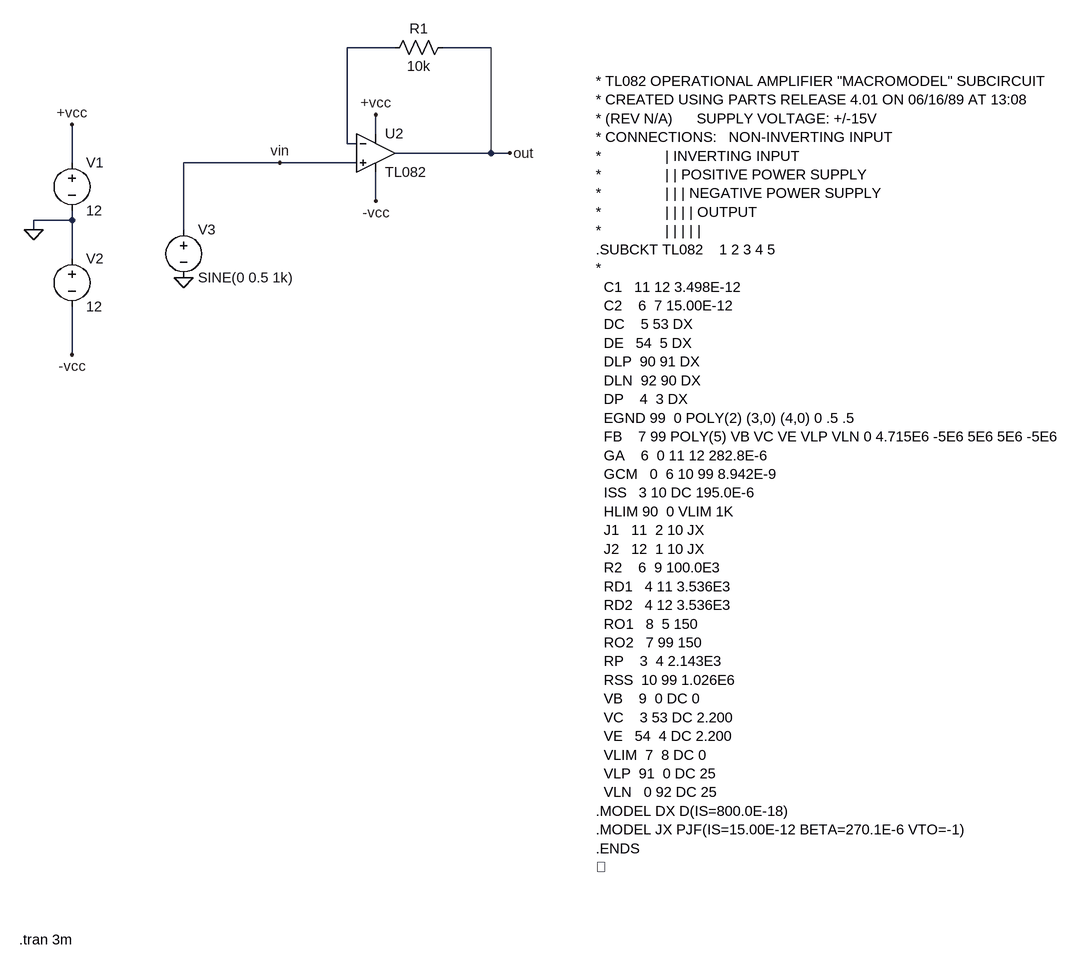
[diagram p0: schematic circuito com TL082.asc]
circuito com TL082.asc, the LTspice schematic file:
Version 4
SHEET 1 2480 11288
WIRE 720 -96 640 -96
WIRE 880 -96 800 -96
WIRE 688 48 688 16
WIRE 640 64 640 -96
WIRE 656 64 640 64
WIRE 880 80 880 -96
WIRE 880 80 720 80
WIRE 912 80 880 80
WIRE 80 96 80 32
WIRE 528 96 368 96
WIRE 656 96 528 96
WIRE 688 160 688 112
WIRE 80 192 80 176
WIRE 80 192 16 192
WIRE 16 208 16 192
WIRE 368 208 368 96
WIRE 80 256 80 192
WIRE 80 416 80 336
FLAG 16 208 0
FLAG 80 416 -vcc
FLAG 80 32 +vcc
FLAG 368 288 0
FLAG 688 16 +vcc
FLAG 688 160 -vcc
FLAG 912 80 out
FLAG 528 96 vin
SYMBOL voltage 80 80 R0
WINDOW 123 0 0 Left 0
WINDOW 39 0 0 Left 0
SYMATTR InstName V1
SYMATTR Value 12
SYMBOL voltage 80 240 R0
WINDOW 123 0 0 Left 0
WINDOW 39 0 0 Left 0
SYMATTR InstName V2
SYMATTR Value 12
SYMBOL voltage 368 192 R0
WINDOW 123 0 0 Left 0
WINDOW 39 0 0 Left 0
SYMATTR InstName V3
SYMATTR Value SINE(0 0.5 1k)
SYMBOL res 816 -112 R90
WINDOW 0 0 56 VBottom 2
WINDOW 3 32 56 VTop 2
SYMATTR InstName R1
SYMATTR Value 10k
SYMBOL Opamps\\opamp2 688 16 R0
SYMATTR InstName U2
SYMATTR Value TL082
TEXT -8 11272 Left 2 !.tran 3m
TEXT 1584 -40 Left 2 !* TL082 OPERATIONAL AMPLIFIER "MACROMODEL" SUBCIRCUIT\n* CREATED USING PARTS RELEASE 4.01 ON 06/16/89 AT 13:08\n* (REV N/A)      SUPPLY VOLTAGE: +/-15V\n* CONNECTIONS:   NON-INVERTING INPUT\n*                | INVERTING INPUT\n*                | | POSITIVE POWER SUPPLY\n*                | | | NEGATIVE POWER SUPPLY\n*                | | | | OUTPUT\n*                | | | | |\n.SUBCKT TL082    1 2 3 4 5\n*\n  C1   11 12 3.498E-12\n  C2    6  7 15.00E-12\n  DC    5 53 DX\n  DE   54  5 DX\n  DLP  90 91 DX\n  DLN  92 90 DX\n  DP    4  3 DX\n  EGND 99  0 POLY(2) (3,0) (4,0) 0 .5 .5\n  FB    7 99 POLY(5) VB VC VE VLP VLN 0 4.715E6 -5E6 5E6 5E6 -5E6\n  GA    6  0 11 12 282.8E-6\n  GCM   0  6 10 99 8.942E-9\n  ISS   3 10 DC 195.0E-6\n  HLIM 90  0 VLIM 1K\n  J1   11  2 10 JX\n  J2   12  1 10 JX\n  R2    6  9 100.0E3\n  RD1   4 11 3.536E3\n  RD2   4 12 3.536E3\n  RO1   8  5 150\n  RO2   7 99 150\n  RP    3  4 2.143E3\n  RSS  10 99 1.026E6\n  VB    9  0 DC 0\n  VC    3 53 DC 2.200\n  VE   54  4 DC 2.200\n  VLIM  7  8 DC 0\n  VLP  91  0 DC 25\n  VLN   0 92 DC 25\n.MODEL DX D(IS=800.0E-18)\n.MODEL JX PJF(IS=15.00E-12 BETA=270.1E-6 VTO=-1)\n.ENDS\n

The netlist it stands for:
* circuito com TL082.asc
V1 +vcc 0 12
V2 0 -vcc 12
V3 vin 0 SINE(0 0.5 1k)
R1 out N001 10k
XU2 vin N001 +vcc -vcc out TL082  ; pins In+ In- V+ V- OUT
.tran 3m
* TL082 OPERATIONAL AMPLIFIER "MACROMODEL" SUBCIRCUIT
* CREATED USING PARTS RELEASE 4.01 ON 06/16/89 AT 13:08
* (REV N/A)      SUPPLY VOLTAGE: +/-15V
* CONNECTIONS:   NON-INVERTING INPUT
*                | INVERTING INPUT
*                | | POSITIVE POWER SUPPLY
*                | | | NEGATIVE POWER SUPPLY
*                | | | | OUTPUT
*                | | | | |
.SUBCKT TL082    1 2 3 4 5
*
  C1   11 12 3.498E-12
  C2    6  7 15.00E-12
  DC    5 53 DX
  DE   54  5 DX
  DLP  90 91 DX
  DLN  92 90 DX
  DP    4  3 DX
  EGND 99  0 POLY(2) (3,0) (4,0) 0 .5 .5
  FB    7 99 POLY(5) VB VC VE VLP VLN 0 4.715E6 -5E6 5E6 5E6 -5E6
  GA    6  0 11 12 282.8E-6
  GCM   0  6 10 99 8.942E-9
  ISS   3 10 DC 195.0E-6
  HLIM 90  0 VLIM 1K
  J1   11  2 10 JX
  J2   12  1 10 JX
  R2    6  9 100.0E3
  RD1   4 11 3.536E3
  RD2   4 12 3.536E3
  RO1   8  5 150
  RO2   7 99 150
  RP    3  4 2.143E3
  RSS  10 99 1.026E6
  VB    9  0 DC 0
  VC    3 53 DC 2.200
  VE   54  4 DC 2.200
  VLIM  7  8 DC 0
  VLP  91  0 DC 25
  VLN   0 92 DC 25
.MODEL DX D(IS=800.0E-18)
.MODEL JX PJF(IS=15.00E-12 BETA=270.1E-6 VTO=-1)
.ENDS

.backanno
.end